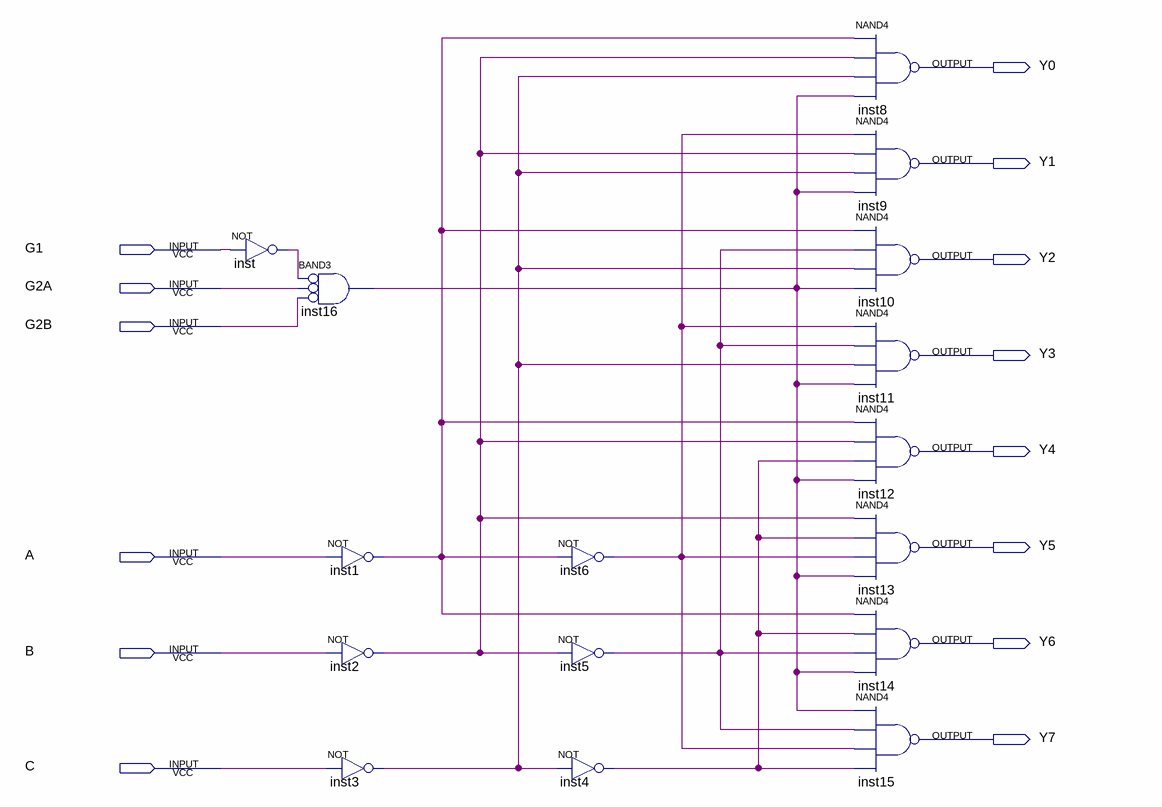
[diagram p0: schematic sheet]
// Quartus schematic DM74LS138.bdf as structural Verilog: 16 symbols, 14 pins
module DM74LS138 (
  input  G1,
  input  G2A,
  input  G2B,
  input  A,
  input  B,
  input  C,
  output Y0,
  output Y1,
  output Y2,
  output Y3,
  output Y4,
  output Y5,
  output Y6,
  output Y7
);

  wire inst1_out, inst2_out, inst3_out, inst4_out, inst5_out, inst6_out, inst16_out, inst_out;

  not inst (inst_out, G1);
  and inst16 (inst16_out, ~inst_out, ~G2A, ~G2B);  // BAND3
  not inst1 (inst1_out, A);
  not inst2 (inst2_out, B);
  not inst3 (inst3_out, C);
  not inst6 (inst6_out, inst1_out);
  not inst5 (inst5_out, inst2_out);
  not inst4 (inst4_out, inst3_out);
  nand inst8 (Y0, inst1_out, inst2_out, inst3_out, inst16_out);
  nand inst9 (Y1, inst6_out, inst2_out, inst3_out, inst16_out);
  nand inst10 (Y2, inst1_out, inst5_out, inst3_out, inst16_out);
  nand inst11 (Y3, inst6_out, inst5_out, inst3_out, inst16_out);
  nand inst12 (Y4, inst1_out, inst2_out, inst4_out, inst16_out);
  nand inst13 (Y5, inst2_out, inst4_out, inst6_out, inst16_out);
  nand inst14 (Y6, inst1_out, inst4_out, inst5_out, inst16_out);
  nand inst15 (Y7, inst16_out, inst5_out, inst6_out, inst4_out);
endmodule
